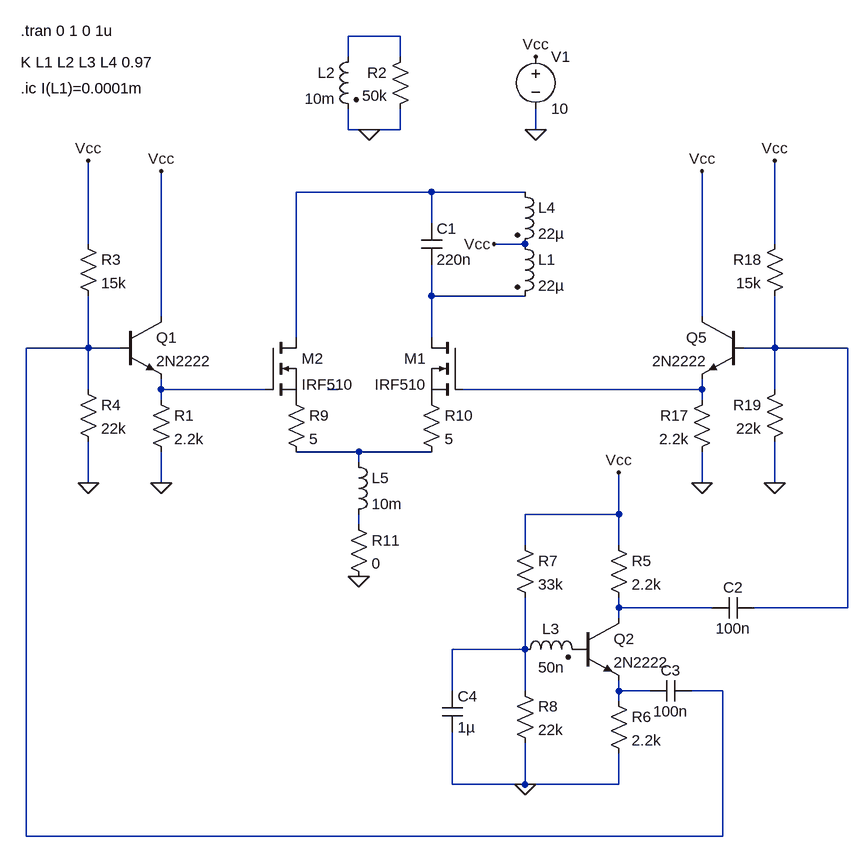
[diagram p0: schematic royer4_mosfet.asc]
royer4_mosfet.asc, the LTspice schematic file:
Version 4
SHEET 1 2216 1428
WIRE 192 16 112 16
WIRE 112 48 112 16
WIRE 192 48 192 16
WIRE 112 160 112 128
WIRE 144 160 112 160
WIRE 192 160 192 128
WIRE 192 160 144 160
WIRE 400 160 400 128
WIRE 240 256 32 256
WIRE 384 256 240 256
WIRE 240 304 240 256
WIRE -288 336 -288 208
WIRE 384 336 336 336
WIRE 768 336 768 208
WIRE 240 416 240 368
WIRE 384 416 240 416
WIRE -176 448 -176 224
WIRE 656 448 656 224
WIRE 32 480 32 256
WIRE 240 480 240 416
WIRE -288 496 -288 416
WIRE -288 496 -384 496
WIRE -240 496 -288 496
WIRE 768 496 768 416
WIRE 768 496 720 496
WIRE 880 496 768 496
WIRE -288 560 -288 496
WIRE -176 560 -176 544
WIRE -16 560 -176 560
WIRE 96 560 80 560
WIRE 656 560 656 544
WIRE 656 560 288 560
WIRE 768 560 768 496
WIRE -176 576 -176 560
WIRE 656 576 656 560
WIRE 128 656 32 656
WIRE 240 656 128 656
WIRE 128 672 128 656
WIRE -288 704 -288 640
WIRE -176 704 -176 656
WIRE 656 704 656 656
WIRE 768 704 768 640
WIRE 528 752 528 688
WIRE 528 752 384 752
WIRE 128 768 128 752
WIRE 384 800 384 752
WIRE 528 800 528 752
WIRE 528 896 528 880
WIRE 672 896 528 896
WIRE 880 896 880 496
WIRE 880 896 736 896
WIRE 528 912 528 896
WIRE 384 960 384 880
WIRE 384 960 272 960
WIRE 272 1024 272 960
WIRE 384 1024 384 960
WIRE 528 1024 528 1008
WIRE 576 1024 528 1024
WIRE 688 1024 640 1024
WIRE 528 1040 528 1024
WIRE 272 1168 272 1088
WIRE 384 1168 384 1104
WIRE 384 1168 272 1168
WIRE 528 1168 528 1120
WIRE 528 1168 384 1168
WIRE -384 1248 -384 496
WIRE 688 1248 688 1024
WIRE 688 1248 -384 1248
FLAG 400 160 0
FLAG 400 48 Vcc
FLAG 336 336 Vcc
FLAG 144 160 0
FLAG 384 1168 0
FLAG 528 688 Vcc
FLAG 128 848 0
FLAG 656 224 Vcc
FLAG 656 704 0
FLAG 768 704 0
FLAG 768 208 Vcc
FLAG -176 224 Vcc
FLAG -176 704 0
FLAG -288 704 0
FLAG -288 208 Vcc
SYMBOL voltage 400 32 R0
WINDOW 123 0 0 Left 0
WINDOW 39 0 0 Left 0
SYMATTR InstName V1
SYMATTR Value 10
SYMBOL ind2 368 320 R0
SYMATTR InstName L1
SYMATTR Value 22µ
SYMATTR Type ind
SYMBOL ind2 128 32 M0
SYMATTR InstName L2
SYMATTR Value 10m
SYMATTR Type ind
SYMBOL ind2 368 976 R270
WINDOW 0 32 56 VTop 2
WINDOW 3 4 56 VBottom 2
SYMATTR InstName L3
SYMATTR Value 50n
SYMATTR Type ind
SYMATTR SpiceLine Rser=0.1
SYMBOL ind2 368 240 R0
SYMATTR InstName L4
SYMATTR Value 22µ
SYMATTR Type ind
SYMBOL cap 224 304 R0
SYMATTR InstName C1
SYMATTR Value 220n
SYMBOL res 208 32 M0
SYMATTR InstName R2
SYMATTR Value 50k
SYMBOL npn 464 912 R0
SYMATTR InstName Q2
SYMATTR Value 2N2222
SYMBOL res 512 784 R0
SYMATTR InstName R5
SYMATTR Value 2.2k
SYMBOL res 512 1024 R0
SYMATTR InstName R6
SYMATTR Value 2.2k
SYMBOL res 368 784 R0
SYMATTR InstName R7
SYMATTR Value 33k
SYMBOL res 368 1008 R0
SYMATTR InstName R8
SYMATTR Value 22k
SYMBOL cap 256 1024 R0
SYMATTR InstName C4
SYMATTR Value 1µ
SYMBOL cap 736 880 R90
WINDOW 0 0 32 VBottom 2
WINDOW 3 32 32 VTop 2
SYMATTR InstName C2
SYMATTR Value 100n
SYMBOL cap 640 1008 R90
WINDOW 0 0 32 VBottom 2
WINDOW 3 32 32 VTop 2
SYMATTR InstName C3
SYMATTR Value 100n
SYMBOL res 112 752 R0
SYMATTR InstName R11
SYMATTR Value 0
SYMBOL npn 720 448 M0
SYMATTR InstName Q5
SYMATTR Value 2N2222
SYMBOL res 672 560 M0
SYMATTR InstName R17
SYMATTR Value 2.2k
SYMBOL res 784 320 M0
SYMATTR InstName R18
SYMATTR Value 15k
SYMBOL res 784 544 M0
SYMATTR InstName R19
SYMATTR Value 22k
SYMBOL nmos 288 480 M0
SYMATTR InstName M1
SYMATTR Value IRF510
SYMBOL nmos -16 480 R0
SYMATTR InstName M2
SYMATTR Value IRF510
SYMBOL npn -240 448 R0
SYMATTR InstName Q1
SYMATTR Value 2N2222
SYMBOL res -192 560 R0
SYMATTR InstName R1
SYMATTR Value 2.2k
SYMBOL res -304 320 R0
SYMATTR InstName R3
SYMATTR Value 15k
SYMBOL res -304 544 R0
SYMATTR InstName R4
SYMATTR Value 22k
SYMBOL ind 112 656 R0
SYMATTR InstName L5
SYMATTR Value 10m
SYMBOL res 16 560 R0
SYMATTR InstName R9
SYMATTR Value 5
SYMBOL res 224 560 R0
SYMATTR InstName R10
SYMATTR Value 5
TEXT -392 56 Left 2 !K L1 L2 L3 L4 0.97
TEXT -392 8 Left 2 !.tran 0 1 0 1u
TEXT -392 96 Left 2 !.ic I(L1)=0.0001m

The netlist it stands for:
* royer4_mosfet.asc
V1 Vcc 0 10
L1 Vcc N003 22µ
L2 N001 0 10m
L3 N012 P001 50n Rser=0.1
L4 N002 Vcc 22µ
C1 N002 N003 220n
R2 N001 0 50k
Q2 N011 P001 N013 0 2N2222
R5 Vcc N011 2.2k
R6 N013 0 2.2k
R7 Vcc N012 33k
R8 N012 0 22k
C4 N012 0 1µ
C2 N005 N011 100n
C3 N004 N013 100n
R11 N010 0 0
Q5 Vcc N005 N008 0 2N2222
R17 N008 0 2.2k
R18 Vcc N005 15k
R19 N005 0 22k
M1 N003 N008 P002 P002 IRF510
M2 N002 N006 P003 P003 IRF510
Q1 Vcc N004 N006 0 2N2222
R1 N006 0 2.2k
R3 Vcc N004 15k
R4 N004 0 22k
L5 N009 N010 10m
R9 P003 N009 5
R10 P002 N009 5
.model NPN NPN
.model PNP PNP
.lib standard.bjt
.model NMOS NMOS
.model PMOS PMOS
.lib standard.mos
K L1 L2 L3 L4 0.97
.tran 0 1 0 1u
.ic I(L1)=0.0001m
.backanno
.end